# EAGLE schematic untitled (EAGLE 9.6.2)
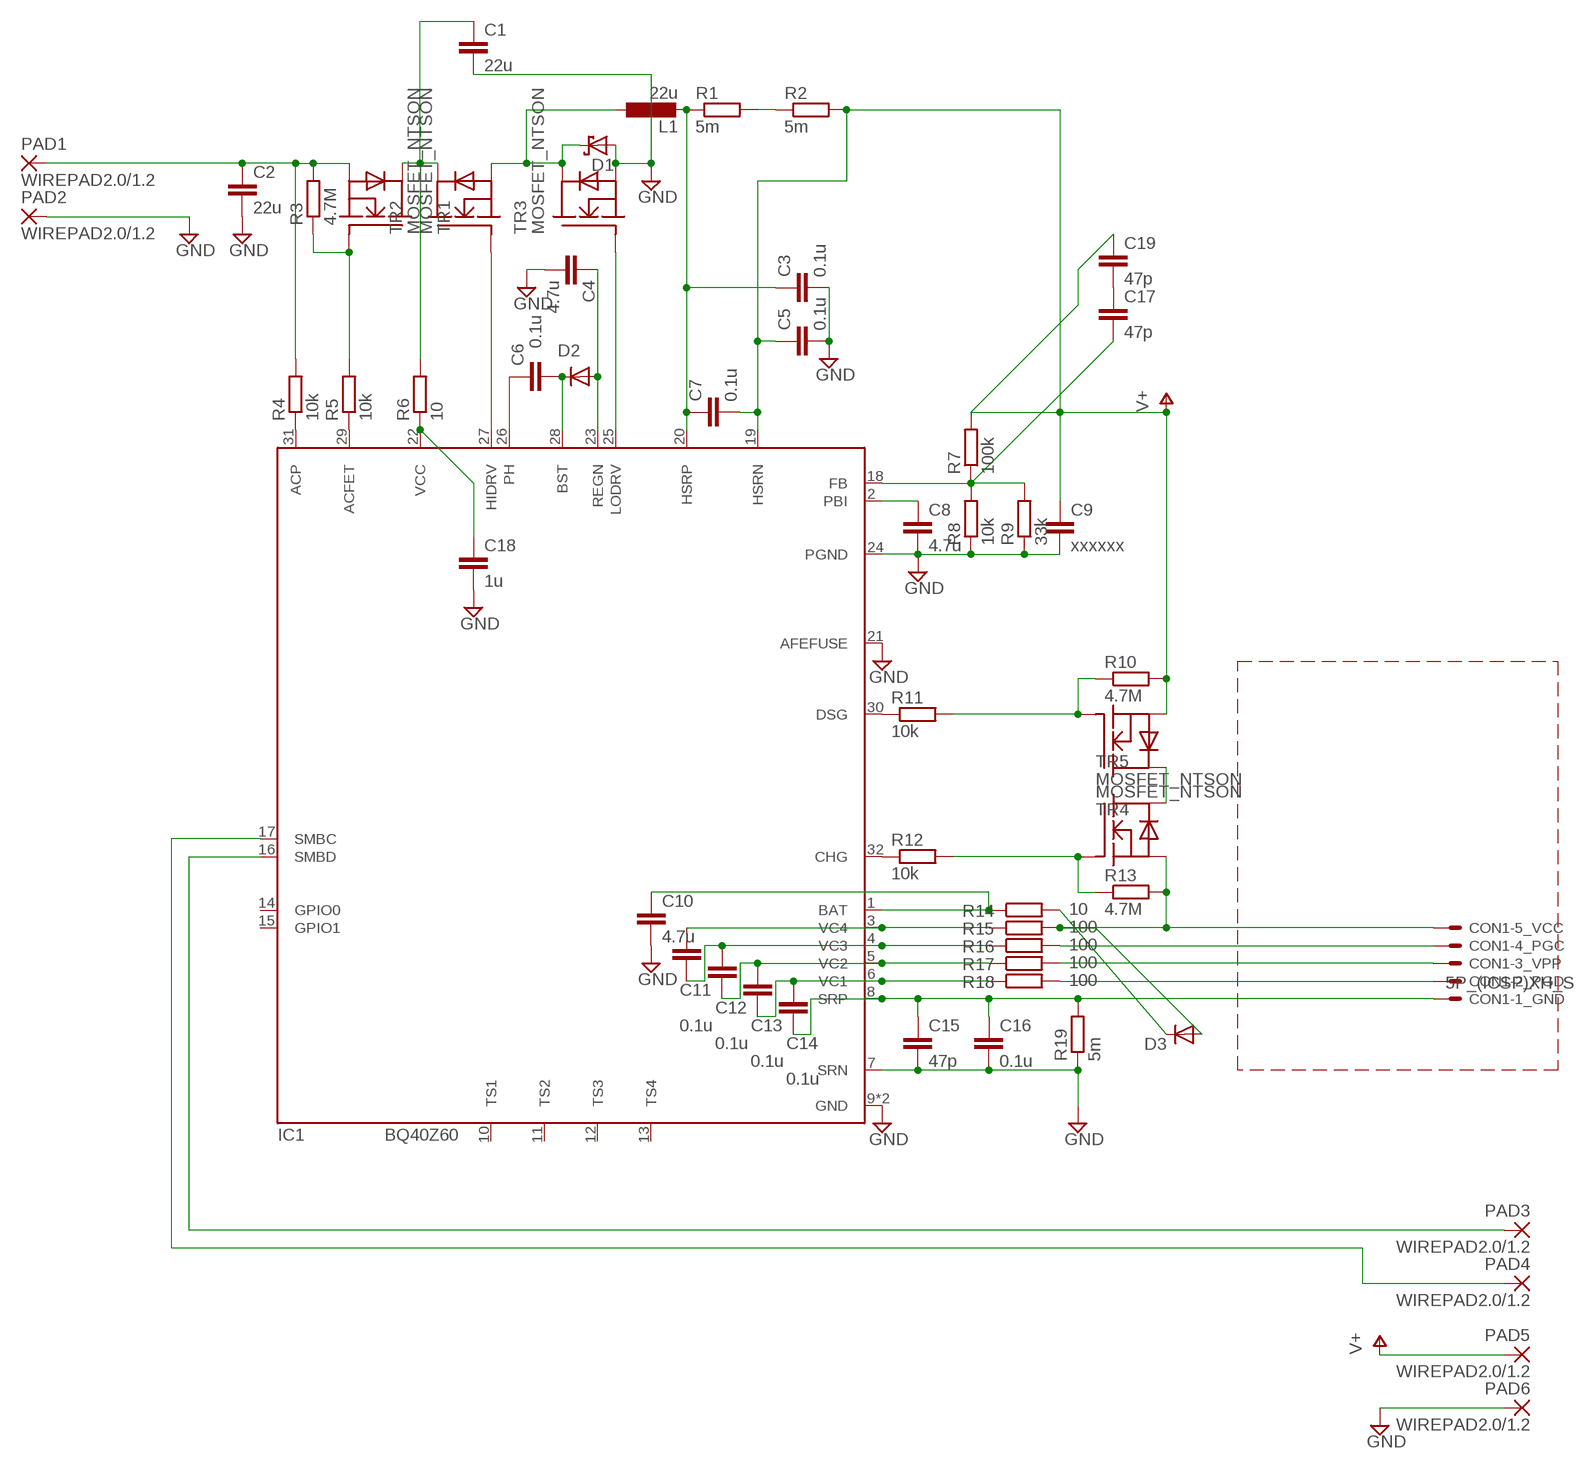
[diagram p0: schematic, sheet 1]

## Parts
C1  22u  C-EUC1210  [C1210]
C2  22u  C-EUC1210  [C1210]
C3  0.1u  C-EUC0402  [C0402]
C4  4.7u  C-EUC0402  [C0402]
C5  0.1u  C-EUC0402  [C0402]
C6  0.1u  C-EUC0402  [C0402]
C7  0.1u  C-EUC0402  [C0402]
C8  4.7u  C-EUC0805  [C0805]
C9  xxxxxx  C-EUC0402  [C0402]
C10  4.7u  C-EUC0805  [C0805]
C11  0.1u  C-EUC0402  [C0402]
C12  0.1u  C-EUC0402  [C0402]
C13  0.1u  C-EUC0402  [C0402]
C14  0.1u  C-EUC0402  [C0402]
C15  47p  C-EUC0402  [C0402]
C16  0.1u  C-EUC0402  [C0402]
C17  47p  C-EUC0402  [C0402]
C18  1u  C-EUC0402  [C0402]
C19  47p  C-EUC0402  [C0402]
CON1  5P_(ICSP)XH_S  [XH-5_S]
D1  SCHOTTKY-DIODETO-277A  [TO-277A]
D2  DIODE-VMN2  [VMN2]
D3  DIODE-VMN2  [VMN2]
IC1  BQ40Z60  [QFN32]
L1  22u  L-EUSCRH125  [SCRH125]
PAD1  WIREPAD2.0/1.2  [2.0/1.3]
PAD2  WIREPAD2.0/1.2  [2.0/1.3]
PAD3  WIREPAD2.0/1.2  [2.0/1.3]
PAD4  WIREPAD2.0/1.2  [2.0/1.3]
PAD5  WIREPAD2.0/1.2  [2.0/1.3]
PAD6  WIREPAD2.0/1.2  [2.0/1.3]
R1  5m  R-EU_R1210  [R1210]
R2  5m  R-EU_R1210  [R1210]
R3  4.7M  R-EU_R0402  [R0402]
R4  10k  R-EU_R0402  [R0402]
R5  10k  R-EU_R0402  [R0402]
R6  10  R-EU_R0402  [R0402]
R7  100k  R-EU_R0402  [R0402]
R8  10k  R-EU_R0402  [R0402]
R9  33k  R-EU_R0402  [R0402]
R10  4.7M  R-EU_R0402  [R0402]
R11  10k  R-EU_R0402  [R0402]
R12  10k  R-EU_R0402  [R0402]
R13  4.7M  R-EU_R0402  [R0402]
R14  10  R-EU_R0402  [R0402]
R15  100  R-EU_R0402  [R0402]
R16  100  R-EU_R0402  [R0402]
R17  100  R-EU_R0402  [R0402]
R18  100  R-EU_R0402  [R0402]
R19  5m  R-EU_R1210  [R1210]
TR1  MOSFET_NTSON  [TSON_ADVANCE]
TR2  MOSFET_NTSON  [TSON_ADVANCE]
TR3  MOSFET_NTSON  [TSON_ADVANCE]
TR4  MOSFET_NTSON  [TSON_ADVANCE]
TR5  MOSFET_NTSON  [TSON_ADVANCE]

## Nets
GND: C1.2 C2.2 C3.2 C4.2 C5.2 C8.2 C9.2 C10.2 C15.2 C16.2 C18.2 D1.A IC1.7(SRN) IC1.9(GND) IC1.21(AFEFUSE) IC1.24(PGND) IC1.EXP(GND) PAD2.1(P) PAD6.1(P) R8.1 R9.1 R19.1 TR3.1(S) TR3.2(S) TR3.3(S)
N$1: CON1.4 R18.2
N$2: R1.2 R2.1
N$3: D3.C R14.2
N$4: CON1.3 R17.2
N$5: C17.1 C19.2
N$7: CON1.2 R16.2
N$10: CON1.1 D3.A R13.2 R15.2 TR5.1(S) TR5.2(S) TR5.3(S)
N$11: TR4.5(D) TR4.6(D) TR4.7(D) TR4.8(D) TR4.DRAIN1(D) TR4.DRAIN2(D) TR5.5(D) TR5.6(D) TR5.7(D) TR5.8(D) TR5.DRAIN1(D) TR5.DRAIN2(D)
N$13: C14.2 C15.1 C16.1 CON1.5 IC1.8(SRP) R19.2
N$17: C10.1 IC1.1(BAT) R14.1
N$18: IC1.30(DSG) R11.1
N$20: IC1.32(CHG) R12.1
N$21: R12.2 R13.1 TR5.4(G)
N$23: R10.1 R11.2 TR4.4(G)
N$28: C8.1 IC1.2(PBI)
N$29: C11.2 C12.1 IC1.4(VC3) R16.1
N$30: C17.2 IC1.18(FB) R7.1 R8.2 R9.2
N$43: C12.2 C13.1 IC1.5(VC2) R17.1
N$44: IC1.29(ACFET) R5.1
N$45: R3.1 R5.2 TR1.4(G)
N$46: C6.1 IC1.26(PH)
N$47: C6.2 D2.C IC1.28(BST)
N$48: C4.1 D2.A IC1.23(REGN)
N$49: D1.C L1.1 TR2.1(S) TR2.2(S) TR2.3(S) TR3.5(D) TR3.6(D) TR3.7(D) TR3.8(D) TR3.DRAIN1(D) TR3.DRAIN2(D)
N$50: C1.1 R6.2 TR1.5(D) TR1.6(D) TR1.7(D) TR1.8(D) TR1.DRAIN1(D) TR1.DRAIN2(D) TR2.5(D) TR2.6(D) TR2.7(D) TR2.8(D) TR2.DRAIN1(D) TR2.DRAIN2(D)
N$51: IC1.27(HIDRV) TR2.4(G)
N$52: IC1.25(LODRV) TR3.4(G)
N$63: C3.1 C7.1 IC1.20(HSRP) L1.2 R1.1
N$65: IC1.31(ACP) R4.1
N$66: C2.1 PAD1.1(P) R3.2 R4.2 TR1.1(S) TR1.2(S) TR1.3(S)
N$67: C18.1 IC1.22(VCC) R6.1
N$68: C13.2 C14.1 IC1.6(VC1) R18.1
N$69: C11.1 IC1.3(VC4) R15.1
N$70: IC1.17(SMBC) PAD4.1(P)
N$71: IC1.16(SMBD) PAD3.1(P)
V+: C5.1 C7.2 C9.1 C19.1 IC1.19(HSRN) PAD5.1(P) R2.2 R7.2 R10.2 TR4.1(S) TR4.2(S) TR4.3(S)
Unconnected: IC1.10(TS1) IC1.11(TS2) IC1.12(TS3) IC1.13(TS4) IC1.14(GPIO0) IC1.15(GPIO1)

## Library data of the parts
C1-C19 = rcl:C-EU: CAPACITOR, European symbol; SPICEPREFIX: C
CON1 = 4 CONNECTOR:5P_(ICSP)
D1 = 0 my parts:SCHOTTKY-DIODE: Schottky Diode
D2 D3 = 5 D:DIODE-: DIODE
IC1 = 0 my parts:BQ40Z60
L1 = 2 RCL:L-EU: INDUCTOR, European symbol
PAD1-PAD6 = 4 PAD:WIREPAD: Wire PAD connect wire on PCB
R1-R19 = rcl:R-EU_: RESISTOR, European symbol; SPICEPREFIX: R
TR1-TR5 = 0 my parts:MOSFET_N